# Altium project BrewController.PrjPcb (part 2 of 2)

## Sheet ESP32-WROOM-32D_Module.SchDoc
size A4
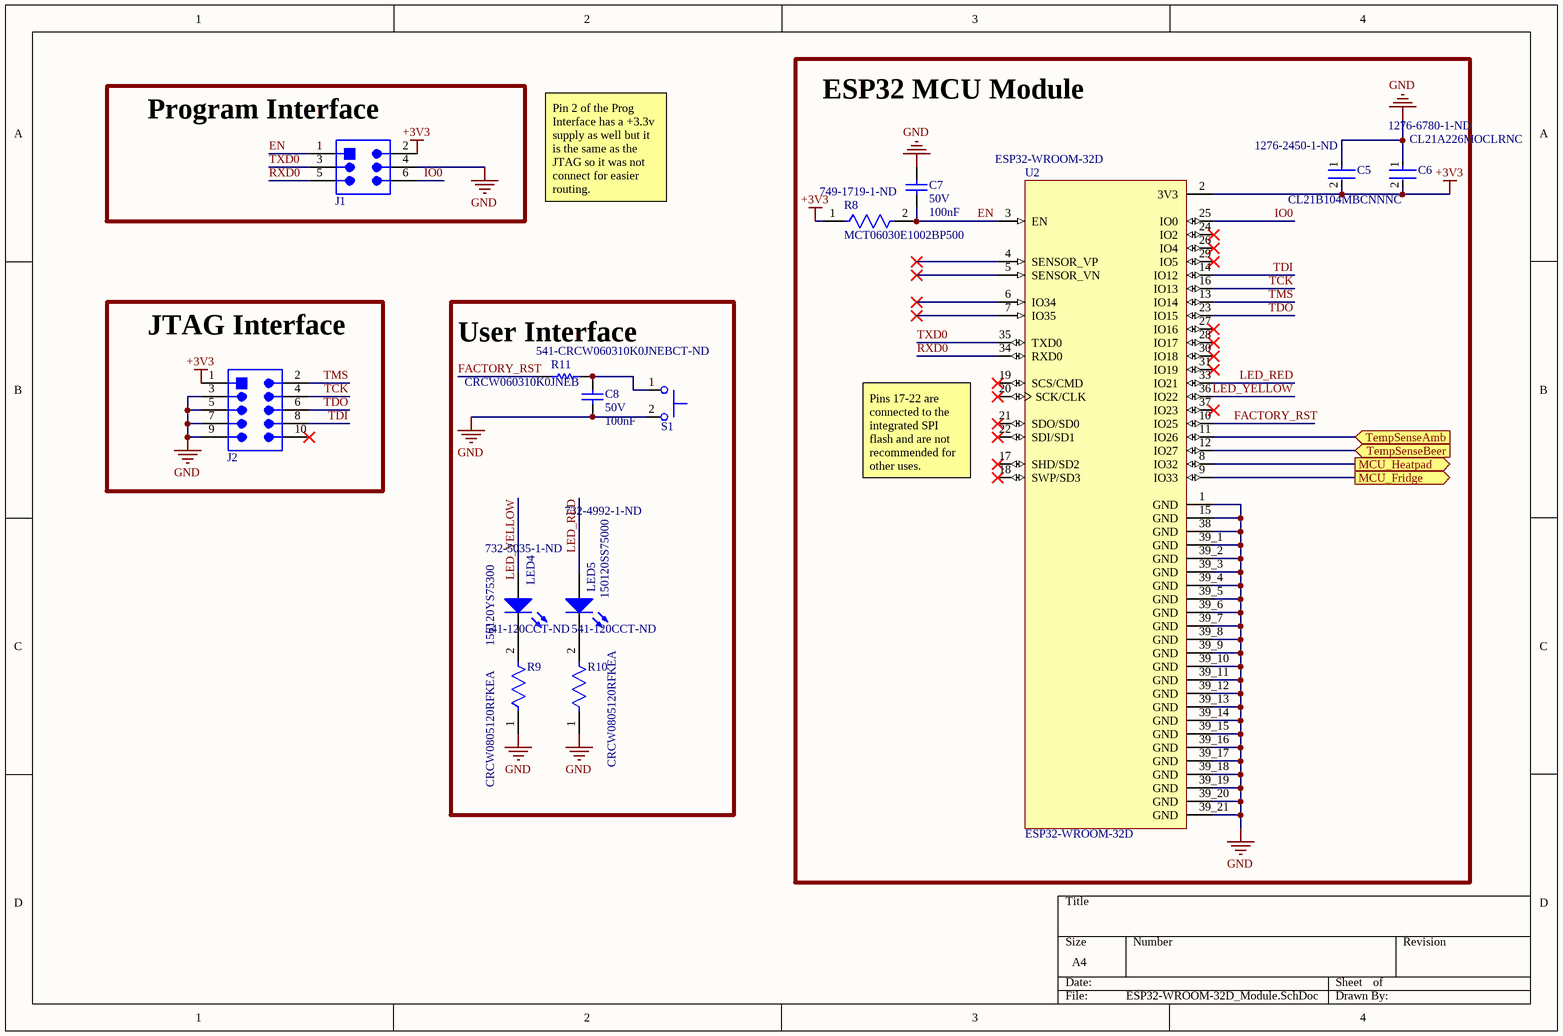
[diagram p2: ESP32-WROOM-32D_Module.SchDoc]

### Parts
C5  CL21B104MBCNNNC  Supplier Part Number 1: 1276-2450-1-ND  [FP-CL21-IPC_B]
C6  CL21A226MOCLRNC  Supplier Part Number 1: 1276-6780-1-ND  [FP-CL21-IPC_C]
C7  Voltage Rating (DC): 50V  Capacitance: 100nF  [C0805]  (hidden comment: Cap 0.1uF/50V 0805 X7R (CL21B104MBCNNNC))
C8  Voltage Rating (DC): 50V  Capacitance: 100nF  [C0805]  (hidden comment: Cap 0.1uF/50V 0805 X7R (CL21B104MBCNNNC))
J1  6Pos 1.27mm Unkeyed (20021111-00006T4LF)  [6Pos_1.27_Keyed]  (value not drawn)
J2  10Pos 1.27mm Keyed (3220-10-0100-00)  [10pos_1.27_Keyed]  (value not drawn)
LED4  156120YS75300  Supplier Part Number 1: 732-5035-1-ND  [1206  CYLINDRICAL- Reverse Use]
LED5  150120SS75000  Supplier Part Number 1: 732-4992-1-ND  [1206_A]
R8  MCT06030E1002BP500  Supplier Part Number 1: 749-1719-1-ND  [FP-MCT0603-MFG]
R9  CRCW0805120RFKEA  Supplier Part Number 1: 541-120CCT-ND  [FP-CRCW0805-e3-IPC_C]
R10  CRCW0805120RFKEA  Supplier Part Number 1: 541-120CCT-ND  [FP-CRCW0805-e3-IPC_C]
R11  CRCW060310K0JNEB  Supplier Part Number 1: 541-CRCW060310K0JNEBCT-ND  [RESC1609X50X30LL10T20]
S1  Right Angle SMT Edge Switch  [TL4110 Edge Connector]  (value not drawn)
U2  ESP32-WROOM-32D  [*MODULE_ESP32-WROOM-32D_ESP32-WROOM-32D(Primary)]

### Blocks framed on the sheet
Program Interface: J1
ESP32 MCU Module: C5-C7 R8 U2
JTAG Interface: J2
User Interface: C8 LED4 LED5 R9-R11 S1

### Ports
MCU_Fridge (out), MCU_Heatpad (out), TempSenseAmb (in), TempSenseBeer (in)

### Nets
+3V3: C5.2 C6.2 J1.2 J2.1 R8.1 U2.2(3V3)
GND: C5.1 C6.1 C7.2 C8.1 J1.4 J2.3 J2.5 J2.7 J2.9 R9.1 R10.1 S1.2 U2.1(GND) U2.15(GND) U2.38(GND) U2.39_1(GND) U2.39_2(GND) U2.39_3(GND) U2.39_4(GND) U2.39_5(GND) U2.39_6(GND) U2.39_7(GND) U2.39_8(GND) U2.39_9(GND) U2.39_10(GND) U2.39_11(GND) U2.39_12(GND) U2.39_13(GND) U2.39_14(GND) U2.39_15(GND) U2.39_16(GND) U2.39_17(GND) U2.39_18(GND) U2.39_19(GND) U2.39_20(GND) U2.39_21(GND)
EN: C7.1 J1.1 R8.2 U2.3(EN)
FACTORY_RST: R11.1 U2.10(IO25)
IO0: J1.6 U2.25(IO0)
LED_RED: LED5.2(A) U2.33(IO21)
LED_YELLOW: LED4.2(A) U2.36(IO22)
RXD0: J1.5 U2.34(RXD0)
TCK: J2.4 U2.16(IO13)
TDI: J2.8 U2.14(IO12)
TDO: J2.6 U2.23(IO15)
TMS: J2.2 U2.13(IO14)
TXD0: J1.3 U2.35(TXD0)
NetC8_2: C8.2 R11.2 S1.1
NetCON1_2: U2.11(IO26) ; port TempSenseAmb
NetCON2_2: U2.12(IO27) ; port TempSenseBeer
NetLED4_1: LED4.1(K) R9.2
NetLED5_1: LED5.1(K) R10.2
NetQ1_1: U2.8(IO32) ; port MCU_Heatpad
NetQ2_1: U2.9(IO33) ; port MCU_Fridge

Not connected (* = marked no-connect by the designer): J2 10*; U2 4(SENSOR_VP)* 5(SENSOR_VN)* 6(IO34)* 7(IO35)* 17(SHD/SD2)* 18(SWP/SD3)* 19(SCS/CMD)* 20(SCK/CLK)* 21(SDO/SD0)* 22(SDI/SD1)* 24(IO2)* 26(IO4)* 27(IO16)* 28(IO17)* 29(IO5)* 30(IO18)* 31(IO19)* 37(IO23)*

### Notes on the sheet
- Pin 2 of the Prog Interface has a +3.3v supply as well but it is the same as the JTAG so it was not connect for easier routing.
- Pins 17-22 are connected to the integrated SPI flash and are not recommended for other uses.

### Library data of the parts
C5 = CMP-13271-001110-1: CL21 Series 0805 100nF 50V ±20% Tolerance X7R Multilayer Ceramic Chip Capacitor; Manufacturer: Samsung; Description: Cap Ceramic 0.1uF 50V X7R 20% SMD 0805 125C Paper T/R; Depth: 1.25mm; Case Code (Imperial): 0805; Radiation Hardening: No; Length: 2mm; Voltage: 50V; Package Quantity: 1; Lead Free: Lead Free; Voltage Rating: 50V; Case/Package: 0805; Packaging: Tape and Reel; Thickness: 0.037inch; Case Code (Metric): 2012; Dielectric: X7R; Height: 0.85mm; Capacitance: 100nF; Mount: Surface Mount; Voltage Rating (DC): 50V; Tolerance: 20%; Width: 0.049inch; Max Operating Temperature: 125°C; Min Operating Temperature: -55°C; Supplier 1: Digi-Key; Manufacturer Part Number: CL21B104MBCNNNC; RoHS: Yes; Category: Ceramic Capacitors; Stock 1: 1894069; ComponentLink1URL: https://datasheet.ciiva.com/16428/cl21b104mbcnnnc-16428869.pdf?src-supplier=Future+Electronics; ComponentLink1Description: https://datasheet.ciiva.com/16428/cl21b104mbcnnnc-16428869.pdf?src-supplier=Future+Electronics; ComponentLink2URL: https://datasheet.ciiva.com/26838/getdatasheetpartid-746552-26838664.pdf?src-supplier=Verical; ComponentLink2Description: https://datasheet.ciiva.com/26838/getdatasheetpartid-746552-26838664.pdf?src-supplier=Verical; ComponentLink3URL: https://datasheet.ciiva.com/25780/cl21b104mbcnnnc-25780224.pdf?src-supplier=Digi-Key; ComponentLink3Description: https://datasheet.ciiva.com/25780/cl21b104mbcnnnc-25780224.pdf?src-supplier=Digi-Key
C6 = CMP-13271-002990-1: CL21 Series 0805 22uF 16V ±20% Tolerance X5R Multilayer Ceramic Chip Capacitor; Manufacturer: Samsung; Description: CAP CER 22UF 16V X5R 0805; Case Code (Imperial): 0805; Capacitance: 22uF; Max Operating Temperature: 85°C; Min Operating Temperature: -55°C; Packaging: Tape and Reel; Case Code (Metric): 2012; Case/Package: 0805; Mount: Surface Mount; Tolerance: 20%; Thickness: 0.037inch; Voltage Rating: 16V; Width: 0.049inch; Length: 0.079inch; Supplier 1: Digi-Key; Manufacturer Part Number: CL21A226MOCLRNC; RoHS: Yes; Category: Ceramic Capacitors; Stock 1: 613946; ComponentLink1URL: http://www.samsungsem.com/kr/support/product-search/mlcc/CL21A226MOCLRNC.jsp?src-supplier=Digi-Key; ComponentLink1Description: http://www.samsungsem.com/kr/support/product-search/mlcc/CL21A226MOCLRNC.jsp?src-supplier=Digi-Key
C7 C8 = Cap 0.1uF/50V 0805 X7R (CL21B104MBCNNNC): Cap Ceramic 0.1uF 50V X7R 20% SMD 0805 125C Paper T/R; Manufacturer 1: Samsung; Supplier 1: Digi-Key; Supplier Part Number 1: 1276-2450-1-ND; Manufacturer Part Number 1: CL21B104MBCNNNC; Stock 1: 1894069; Pricing 1: 1=0.10000, 10=0.04500, 100=0.02020, 500=0.01444, 1000=0.01134 (USD); RoHS: Yes; Mount: Surface Mount; Case/Package: 0805; Case Code (Imperial): 0805; Case Code (Metric): 2012; Min Operating Temperature: -55°C; Max Operating Temperature: 125°C; Tolerance: 20%; Dielectric: X7R; Voltage: 50V; Package Quantity: 1; Packaging: Tape and Reel; Length: 2mm; Height: 0.85mm; Depth: 1.25mm; Width: 0.049inch; Thickness: 0.037inch; Radiation Hardening: No; Lead Free: Lead Free; ComponentLink1URL: https://datasheet.ciiva.com/16428/cl21b104mbcnnnc-16428869.pdf?src-supplier=Future+Electronics; ComponentLink1Description: https://datasheet.ciiva.com/16428/cl21b104mbcnnnc-16428869.pdf?src-supplier=Future+Electronics; ComponentLink2URL: https://datasheet.ciiva.com/26838/getdatasheetpartid-746552-26838664.pdf?src-supplier=Verical; ComponentLink2Description: https://datasheet.ciiva.com/26838/getdatasheetpartid-746552-26838664.pdf?src-supplier=Verical; ComponentLink3URL: https://datasheet.ciiva.com/25780/cl21b104mbcnnnc-25780224.pdf?src-supplier=Digi-Key; ComponentLink3Description: https://datasheet.ciiva.com/25780/cl21b104mbcnnnc-25780224.pdf?src-supplier=Digi-Key; Voltage Rating: 50V; Manufacturer: Samsung; Manufacturer Part Number: CL21B104MBCNNNC; Category: Ceramic Capacitors
J1 = 6Pos 1.27mm Unkeyed (20021111-00006T4LF): CONN HEADER 6POS UNSHD VERT T/H; Manufacturer 1: Amphenol FCI; Number of Contacts: 6; Max Voltage Rating (AC): 125V; Insulation Resistance: 100MR; Connector Type: Male Pin,Header; Gender: Male; Contact Resistance: 30mR; Current Rating: 6A; Contact Post Length: 2.3mm; Row Spacing: 0.05inch; Supplier 1: Digi-Key; Supplier Part Number 1: 609-3710-ND; Manufacturer Part Number 1: 20021111-00006T4LF; Stock 1: 8493; Pricing 1: 1=0.42000, 10=0.39200, 100=0.30080, 500=0.26160, 1000=0.21582, 5000=0.18966, 10000=0.17658 (USD); RoHS: Yes; Mount: Through Hole; Contact Plating: Gold; Housing Material: Thermoplastic; Contact Material: Nickel,Copper Alloy,Copper,Gold; Color: Black; Housing Color: Black; Min Operating Temperature: -40°C; Max Operating Temperature: 85°C; Termination: Solder; Number of Rows: 2; Packaging: Rail/Tube; Package Quantity: 153; Voltage Rating: 125V; Orientation: Straight; Number of Positions: 6; Length: 3.81mm; Pitch: 1.27mm; Depth: 3.4mm; Contact Mating Length: 0.12inch; REACH SVHC: No SVHC; Lead Free: Lead Free; ComponentLink1URL: https://datasheet.ciiva.com/1433/1079612-1433265.pdf?src-supplier=Element14; ComponentLink1Description: https://datasheet.ciiva.com/1433/1079612-1433265.pdf?src-supplier=Element14; ComponentLink2URL: https://datasheet.ciiva.com/10033/20021111-10033816.pdf?src-supplier=Avnet; ComponentLink2Description: https://datasheet.ciiva.com/10033/20021111-10033816.pdf?src-supplier=Avnet; ComponentLink3URL: https://datasheet.ciiva.com/409/20021111-409250.pdf?src-supplier=Digi-Key; ComponentLink3Description: https://datasheet.ciiva.com/409/20021111-409250.pdf?src-supplier=Digi-Key; ComponentLink4URL: https://datasheet.ciiva.com/5131/20021111-5131319.pdf?src-supplier=Mouser; ComponentLink4Description: https://datasheet.ciiva.com/5131/20021111-5131319.pdf?src-supplier=Mouser; Manufacturer: Amphenol FCI; Manufacturer Part Number: 20021111-00006T4LF; Category: Headers and Wire Housings
J2 = 10Pos 1.27mm Keyed (3220-10-0100-00): CONN HEADER VERT 10POS 1.27MM; Manufacturer 1: CNC Tech; Connector Type: Male Pin; Number of Positions: 10; Pitch: 0.05inch; Supplier 1: Digi-Key; Supplier Part Number 1: 1175-1627-ND; Manufacturer Part Number 1: 3220-10-0100-00; Stock 1: 83441; Pricing 1: 1=0.58000, 10=0.54000, 100=0.41400, 500=0.36000, 1000=0.29700, 5000=0.26100, 10000=0.24300 (USD); RoHS: Yes; Mount: Through Hole; Contact Plating: Gold; Package Quantity: 3200; Packaging: Tray; Number of Rows: 2; Termination: Solder; Row Spacing: 0.05inch; ComponentLink1URL: https://datasheet.ciiva.com/18655/3220-xx-0100-00-18655342.pdf?src-supplier=Digi-Key; ComponentLink1Description: https://datasheet.ciiva.com/18655/3220-xx-0100-00-18655342.pdf?src-supplier=Digi-Key; Manufacturer: CNC Tech; Manufacturer Part Number: 3220-10-0100-00; Category: Headers and Wire Housings
LED4 = CMP-1428-00001-1: SMD mono-color reverse mount waterclear Chip LED, WL-SMRW, Yellow; Manufacturer: Wuerth Elektronik; Lens Type: Cylindrical; Luminous Intensity: 80mcd; Viewing Angle: 140°; Forward Voltage: 2V; Wavelength: 589nm; Forward Current: 25mA; Test Current: 20mA; ComponentLink2URL: http://katalog.we-online.com/led/datasheet/156120YS75300.pdf; ComponentLink1Description: Manufacturer URL; Color: Yellow; ComponentLink2Description: Datasheet; PackageReference: 1206  CYLINDRICAL- Reverse Use; ComponentLink1URL: http://www.we-online.com; PartNumber: 156120YS75300; Supplier 1: Digi-Key; Manufacturer Part Number: 156120YS75300; RoHS: Yes; Category: LEDs; Stock 1: 2873; Mount: Surface Mount; Case/Package: 1206; Case Code (Metric): 3216; Case Code (Imperial): 1206; Min Operating Temperature: -40°C; Max Operating Temperature: 80°C; Package Quantity: 2000; Packaging: Tape and Reel; Lens Style: Cylindrical; Dominant Wavelength: 589nm; Length: 3.2mm; Height: 1.2mm; Width: 1.6mm; REACH SVHC: Unknown; ComponentLink3URL: https://datasheet.ciiva.com/23843/156120ys75300-23843300.pdf?src-supplier=Newark; ComponentLink3Description: https://datasheet.ciiva.com/23843/156120ys75300-23843300.pdf?src-supplier=Newark; ComponentLink4URL: https://datasheet.ciiva.com/29279/759454-da-01-en-smd-chipled-rev-gelb-156120ys75300-29279081.pdf?src-supplier=Conrad; ComponentLink4Description: https://datasheet.ciiva.com/29279/759454-da-01-en-smd-chipled-rev-gelb-156120ys75300-29279081.pdf?src-supplier=Conrad; ComponentLink5URL: https://datasheet.ciiva.com/29562/156120ys75300-29562981.pdf?src-supplier=Digi-Key; ComponentLink5Description: https://datasheet.ciiva.com/29562/156120ys75300-29562981.pdf?src-supplier=Digi-Key; ComponentLink6URL: https://datasheet.ciiva.com/29562/156120ys75300-29562982.pdf?src-supplier=Digi-Key; ComponentLink6Description: https://datasheet.ciiva.com/29562/156120ys75300-29562982.pdf?src-supplier=Digi-Key; ComponentLink7URL: https://datasheet.ciiva.com/29562/156120ys75300-29562983.pdf?src-supplier=Digi-Key; ComponentLink7Description: https://datasheet.ciiva.com/29562/156120ys75300-29562983.pdf?src-supplier=Digi-Key; ComponentLink8URL: https://datasheet.ciiva.com/22657/1911476-22657082.pdf?src-supplier=Element14; ComponentLink8Description: https://datasheet.ciiva.com/22657/1911476-22657082.pdf?src-supplier=Element14; ComponentLink9URL: https://datasheet.ciiva.com/48430/156120ys75300-eng-tds-48430218.pdf?src-supplier=Distrelec; ComponentLink9Description: https://datasheet.ciiva.com/48430/156120ys75300-eng-tds-48430218.pdf?src-supplier=Distrelec
LED5 = CMP-1426-00017-1: SMD mono-color Chip LED, WL-SMCW, Super Red; Manufacturer: Wuerth Elektronik; Viewing Angle: 140°; Lens Style: Clear,Rectangular; Luminous Intensity: 60mcd; Forward Current: 30mA; Forward Voltage: 1.9V; Wavelength: 630nm; Test Current: 20mA; ComponentLink1URL: http://www.we-online.com; PackageReference: 1206_A; ComponentLink2Description: Datasheet; ComponentLink1Description: Manufacturer URL; ComponentLink2URL: http://katalog.we-online.com/led/datasheet/150120SS75000.pdf; Color: Super Red; PartNumber: 150120SS75000; Supplier 1: Digi-Key; Manufacturer Part Number: 150120SS75000; RoHS: Yes; Category: LEDs; Stock 1: 1722; Mount: Surface Mount; Case/Package: 1206; Case Code (Metric): 3216; Case Code (Imperial): 1206; Min Operating Temperature: -40°C; Max Operating Temperature: 85°C; Package Quantity: 3000; Packaging: Tape and Reel; Dominant Wavelength: 630nm; Length: 3.2mm; Height: 0.68mm; Width: 1.6mm; REACH SVHC: Unknown; ComponentLink3URL: https://datasheet.ciiva.com/29561/150120ss75000-29561862.pdf?src-supplier=Digi-Key; ComponentLink3Description: https://datasheet.ciiva.com/29561/150120ss75000-29561862.pdf?src-supplier=Digi-Key; ComponentLink4URL: https://datasheet.ciiva.com/29279/759443-da-01-en-chipled-1206-w-kl-s-rot-150120ss75000-29279053.pdf?src-supplier=Conrad; ComponentLink4Description: https://datasheet.ciiva.com/29279/759443-da-01-en-chipled-1206-w-kl-s-rot-150120ss75000-29279053.pdf?src-supplier=Conrad; ComponentLink5URL: https://datasheet.ciiva.com/29561/150120ss75000-29561863.pdf?src-supplier=Digi-Key; ComponentLink5Description: https://datasheet.ciiva.com/29561/150120ss75000-29561863.pdf?src-supplier=Digi-Key; ComponentLink6URL: https://datasheet.ciiva.com/48430/150120ss75000-eng-tds-48430055.pdf?src-supplier=Distrelec; ComponentLink6Description: https://datasheet.ciiva.com/48430/150120ss75000-eng-tds-48430055.pdf?src-supplier=Distrelec; ComponentLink7URL: https://datasheet.ciiva.com/29561/150120ss75000-29561864.pdf?src-supplier=Digi-Key; ComponentLink7Description: https://datasheet.ciiva.com/29561/150120ss75000-29561864.pdf?src-supplier=Digi-Key
R8 = CMP-02407-000334-1: RES SMD 100 OHM 1% 1/8W 0603; Manufacturer: Vishay BCcomponents; Max Power Dissipation: 100mW; Resistance: 10kR; Voltage Rating (DC): 75V; Temperature Coefficient: 15ppm/°C; Tolerance: 0.1%; Height: 0.022inch; Length: 0.061inch; Width: 0.033inch; Depth: 0.85mm; Case/Package: 0603; Min Operating Temperature: -55°C; Package Quantity: 5000; Voltage Rating: 75V; Contact Plating: Tin; REACH SVHC: No SVHC; Case Code (Imperial): 0603; Max Operating Temperature: 125°C; Composition: Thin Film; Radiation Hardening: No; Power Rating: 100mW; Packaging: Tape and Reel; Military Standard: Not; Case Code (Metric): 1608; Number of Terminations: 2; Lead Free: Lead Free; Supplier 1: Digi-Key; Manufacturer Part Number: MCT06030E1002BP500; RoHS: Yes; Category: Chip SMD Resistors; Stock 1: 21385; Resistor Type: Thin Film; ComponentLink1URL: https://datasheet.ciiva.com/8897/mc-pre-8897866.pdf?src-supplier=Avnet; ComponentLink1Description: https://datasheet.ciiva.com/8897/mc-pre-8897866.pdf?src-supplier=Avnet; ComponentLink2URL: https://datasheet.ciiva.com/2606/mc-pre-2606078.pdf?src-supplier=Digi-Key; ComponentLink2Description: https://datasheet.ciiva.com/2606/mc-pre-2606078.pdf?src-supplier=Digi-Key
R9 R10 = CMP-02407-007854-1: RES Thick Film, 120Ω, 1%, 0.125W, 100ppm/°C, 0805; Manufacturer: Vishay; Resistance: 120R; Voltage Rating (DC): 150V; Max Power Dissipation: 125mW; Height: 0.45mm; Min Operating Temperature: -55°C; Packaging: Tape and Reel; Package Quantity: 10; Width: 1.25mm; Weight: 0.000194oz; Termination: SMD/SMT; Mount: Surface Mount; Tolerance: 1%; Military Standard: Not; Max Operating Temperature: 155°C; Lead Free: Lead Free; Number of Terminations: 2; Radiation Hardening: No; Temperature Coefficient: 100ppm/°C; Length: 2mm; Case/Package: 0805; Voltage Rating: 150V; Case Code (Metric): 2012; Case Code (Imperial): 0805; Features: Automotive AEC-Q200; Composition: Thick Film; Contact Plating: Tin; Power Rating: 125mW; Depth: 1.25mm; Supplier 1: Digi-Key; Manufacturer Part Number: CRCW0805120RFKEA; RoHS: Yes; Category: Chip SMD Resistors; Stock 1: 76539; Resistor Type: Thick Film; REACH SVHC: Unknown; ComponentLink1URL: https://datasheet.ciiva.com/11810/0900766b80d98b26-11810477.pdf?src-supplier=RSComponents; ComponentLink1Description: https://datasheet.ciiva.com/11810/0900766b80d98b26-11810477.pdf?src-supplier=RSComponents; ComponentLink2URL: https://datasheet.ciiva.com/3258/dcrcwe3-3258069.pdf?src-supplier=Avnet; ComponentLink2Description: https://datasheet.ciiva.com/3258/dcrcwe3-3258069.pdf?src-supplier=Avnet; ComponentLink3URL: https://datasheet.ciiva.com/26317/fld-crcw-e3-data-en-26317334.pdf?src-supplier=Distrelec; ComponentLink3Description: https://datasheet.ciiva.com/26317/fld-crcw-e3-data-en-26317334.pdf?src-supplier=Distrelec; ComponentLink4URL: https://datasheet.ciiva.com/2467/dcrcwe3-2467512.pdf?src-supplier=Digi-Key; ComponentLink4Description: https://datasheet.ciiva.com/2467/dcrcwe3-2467512.pdf?src-supplier=Digi-Key; ComponentLink5URL: https://datasheet.ciiva.com/2467/dcrcwe3-2467513.pdf?src-supplier=Digi-Key; ComponentLink5Description: https://datasheet.ciiva.com/2467/dcrcwe3-2467513.pdf?src-supplier=Digi-Key; ComponentLink6URL: https://datasheet.ciiva.com/16852/dcrcwe3-16852841.pdf?src-supplier=Avnet+Europe; ComponentLink6Description: https://datasheet.ciiva.com/16852/dcrcwe3-16852841.pdf?src-supplier=Avnet+Europe; ComponentLink7URL: https://datasheet.ciiva.com/2467/dcrcwe3-2467514.pdf?src-supplier=Digi-Key; ComponentLink7Description: https://datasheet.ciiva.com/2467/dcrcwe3-2467514.pdf?src-supplier=Digi-Key; ComponentLink8URL: https://datasheet.ciiva.com/7777/1697337-7777354.pdf?src-supplier=Element14; ComponentLink8Description: https://datasheet.ciiva.com/7777/1697337-7777354.pdf?src-supplier=Element14; ComponentLink9URL: https://datasheet.ciiva.com/16788/70201119-16788154.pdf?src-supplier=Allied+Electronics; ComponentLink9Description: https://datasheet.ciiva.com/16788/70201119-16788154.pdf?src-supplier=Allied+Electronics; ComponentLink10URL: https://datasheet.ciiva.com/16211/dcrcwe3-16211931.pdf?src-supplier=Future+Electronics; ComponentLink10Description: https://datasheet.ciiva.com/16211/dcrcwe3-16211931.pdf?src-supplier=Future+Electronics; ComponentLink11URL: https://datasheet.ciiva.com/7777/1720486-7777567.pdf?src-supplier=Element14; ComponentLink11Description: https://datasheet.ciiva.com/7777/1720486-7777567.pdf?src-supplier=Element14
R11 = CMP-2000-03839-1: Res Thick Film 0603 10K Ohm 5% 0.1W(1/10W) ±200ppm/C Molded SMD Automotive Paper T/R; Manufacturer: Vishay Dale; Resistance: 10kR; Temperature Coefficient: 200ppm/°C; Max Power Dissipation: 100mW; Voltage Rating: 75V; Part Number: CRCW060310K0JNEB; Supplier 1: Digi-Key; Manufacturer Part Number: CRCW060310K0JNEB; RoHS: Yes; Category: Chip SMD Resistors; Stock 1: 86; Case/Package: 0603; Weight: 7.1E-05oz; Case Code (Imperial): 0603; Case Code (Metric): 1608; Contact Plating: Tin; Min Operating Temperature: -55°C; Max Operating Temperature: 155°C; Packaging: Tape and Reel; Tolerance: 5%; Resistor Type: Thick Film; Number of Terminations: 2; Power Rating: 100mW; Package Quantity: 10000; Termination: SMD/SMT; Voltage Rating (DC): 75V; Features: Automotive AEC-Q200; Length: 1.55mm; Height: 0.02inch; Width: 0.85mm; Depth: 0.85mm; Radiation Hardening: No; REACH SVHC: Unknown; Military Standard: Not; Lead Free: Lead Free; ComponentLink1URL: https://datasheet.ciiva.com/28588/1747939-28588894.pdf?src-supplier=Element14; ComponentLink1Description: https://datasheet.ciiva.com/28588/1747939-28588894.pdf?src-supplier=Element14; ComponentLink2URL: https://datasheet.ciiva.com/16426/dcrcwe3-16426303.pdf?src-supplier=Future+Electronics; ComponentLink2Description: https://datasheet.ciiva.com/16426/dcrcwe3-16426303.pdf?src-supplier=Future+Electronics
S1 = Right Angle SMT Edge Switch: RIGHT ANGLE SMT TACT SWITCH 2.0M; Manufacturer 1: E-Switch; Manufacturer Part Number 1: TL4110AF160Q; Mechanical Life: 300000Cycles; Throw Configuration: SPST; Illumination Type: Non-Illuminated; Switch Function: Off-Mom; Actuator Type: Standard; Operating Force: 160gf; Switch Travel: 0.13mm; Supplier 1: Digi-Key; Supplier Part Number 1: EG5545CT-ND; RoHS: No; Category: Tactile Switches; Stock 1: 4332; Pricing 1: 1=0.70000, 10=0.67200, 25=0.64640, 100=0.56090, 250=0.51184, 500=0.47564, 1000=0.42653, 2500=0.40068 (USD); Mount: Edge; Min Operating Temperature: -40°C; Max Operating Temperature: 85°C; Packaging: Tape and Reel; Termination: Gull Wing; ComponentLink1URL: https://media.digikey.com/pdf/Data%20Sheets/E-Switch%20PDFs/TL4110_Series_Tact_Switch.pdf?src-supplier=Digi-Key; ComponentLink1Description: https://media.digikey.com/pdf/Data%20Sheets/E-Switch%20PDFs/TL4110_Series_Tact_Switch.pdf?src-supplier=Digi-Key; Manufacturer: E-Switch; Manufacturer Part Number: TL4110AF160Q
U2 = ESP32-WROOM-32D: Wi-Fi/BT BLE Module ESP32-D0WD, SPI Flash, UART, P; Manufacturer 1: Espressif Systems; Interface: I2C,SPI,GPIO,PWM,SDIO,UART; Frequency: 2.5GHz; Data Rate: 150Mbps; Sensitivity: -98dBm; Memory Size: 536KB; Supplier 1: Digi-Key; Supplier Part Number 1: 1904-1023-1-ND; Manufacturer Part Number 1: ESP32-WROOM-32D; Stock 1: 1335; Pricing 1: 1=3.80000 (USD); RoHS: No; Mount: Surface Mount; Case/Package: SMD/SMT; Min Operating Temperature: -40°C; Max Operating Temperature: 85°C; Packaging: Cut Tape; ComponentLink1URL: https://www.espressif.com/sites/default/files/documentation/esp32-wroom-32d_esp32-wroom-32u_datasheet_en.pdf?src-supplier=Digi-Key; ComponentLink1Description: https://www.espressif.com/sites/default/files/documentation/esp32-wroom-32d_esp32-wroom-32u_datasheet_en.pdf?src-supplier=Digi-Key; Supplier 2: Arrow Electronics; Supplier Part Number 2: ESP32-WROOM-32D; Manufacturer: Espressif Systems; Manufacturer Part Number: ESP32-WROOM-32D; Category: RF Receivers, Transceivers

## Sheet Power.SchDoc
size A4
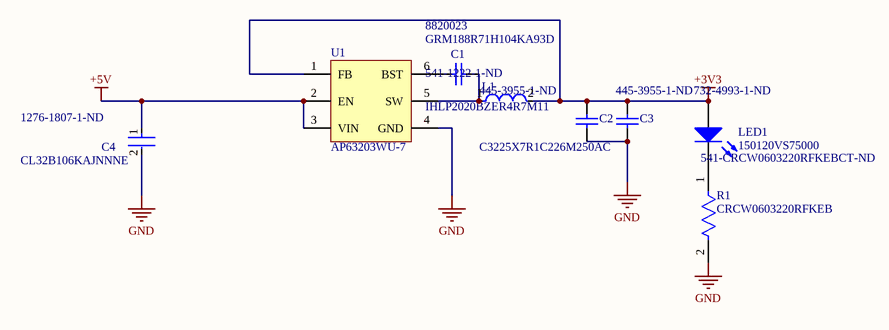
[diagram p3: Power.SchDoc]

### Parts
C1  GRM188R71H104KA93D  Supplier Part Number 1: 8820023  [CAPC1608X90X35ML10T15]
C2  C3225X7R1C226M250AC  Supplier Part Number 1: 445-3955-1-ND  [CAPC3225X280X20LL40]
C3  Supplier Part Number 1: 445-3955-1-ND  [CAPC3225X280X20LL40]  (hidden comment: C3225X7R1C226M250AC)
C4  CL32B106KAJNNNE  Supplier Part Number 1: 1276-1807-1-ND  [FP-CL32-IPC_C]
L1  IHLP2020BZER4R7M11  Supplier Part Number 1: 541-1222-1-ND  [FP-IHLP-2020BZ-FP_1_905x2-MFG]
LED1  150120VS75000  Supplier Part Number 1: 732-4993-1-ND  [1206_A]
R1  CRCW0603220RFKEB  Supplier Part Number 1: 541-CRCW0603220RFKEBCT-ND  [FP-CRCW0603-e3-MFG]
U1  Manufacturer Part Number 1: AP63203WU-7  [TSOT26]  (hidden comment: 3.3V SW Reg (AP63203WU-7))

### Nets
+3V3: C2.2 C3.2 L1.2 LED1.2(A) U1.1(FB)
+5V: C4.1 U1.2(EN) U1.3(VIN)
GND: C2.1 C3.1 C4.2 R1.2 U1.4(GND)
NetC1_1: C1.1 L1.1 U1.5(SW)
NetC1_2: C1.2 U1.6(BST)
NetLED1_1: LED1.1(K) R1.1

### Library data of the parts
C1 = CMP-2100-03643-1: Chip Capacitor, 0.1 uF, +/- 10%, 50 V, -55 to 125 degC, 0603 (1608 Metric), RoHS, Tape and Reel; Manufacturer: Murata; Dielectric Material: Ceramic; Voltage Rating: 50V; Capacitance: 100nF; Dielectric: X7R; Insulation Resistance: 10GR; Description: CERAMIC CAPACITOR, 0.1UF, 50V, X7R, 10%, 0603, FULL REEL; Product Range:GRM Series; Capacitance:0.1 F; Capacitance Tolerance:  10%; Dielectric Characteristic:X7R; Voltage Rating:50V; Ceramic Capacitor Case:0603 ^1608 Metric]; MSL:-; Case Code (Metric): 1608; Lead Free: LeadFree; Depth: 0.8mm; Number of Pins: 2; Radiation Hardening: No; Case/Package: 0603; Manufacturer URL: http://www.murata.com/; Packaging: TapeandReel; Length: 1.6mm; Contact Plating: Tin; Datasheet URL: http://psearch.en.murata.com/capacitor/product/GRM188R71H104KA93%23.pdf; Tolerance: 10%; Case Code (Imperial): 0603; Min Operating Temperature: -55degC; RoHSCompliant: true; Voltage: 50V; Termination: SMD/SMT; Mount: SurfaceMount; Material: Ceramic; Package Quantity: 1; Height: 0.8mm; Thickness: 0.035inch; REACH SVHC: NoSVHC; Max Operating Temperature: 125degC; Width: 0.8mm; Package Reference: 0603; Voltage Rating (DC): 50V; Datasheet Version: 42675.0; Package Description: 2-Pin Surface Mount Device, Body 1.6 x 0.8 mm; Supplier 1: Farnell; Manufacturer Part Number: GRM188R71H104KA93D; RoHS: Yes; Category: Ceramic Capacitors; ComponentLink1URL: https://datasheet.ciiva.com/11786/0900766b807a1cab-11786047.pdf?src-supplier=RSComponents; ComponentLink1Description: https://datasheet.ciiva.com/11786/0900766b807a1cab-11786047.pdf?src-supplier=RSComponents; ComponentLink2URL: https://datasheet.ciiva.com/19467/1857604-19467681.pdf?src-supplier=Jameco; ComponentLink2Description: https://datasheet.ciiva.com/19467/1857604-19467681.pdf?src-supplier=Jameco; ComponentLink3URL: https://datasheet.ciiva.com/29201/451744-da-01-en-vs-kondensator-0603-29201904.pdf?src-supplier=Conrad; ComponentLink3Description: https://datasheet.ciiva.com/29201/451744-da-01-en-vs-kondensator-0603-29201904.pdf?src-supplier=Conrad; ComponentLink4URL: https://datasheet.ciiva.com/28534/4360-28534245.pdf?src-supplier=Element14; ComponentLink4Description: https://datasheet.ciiva.com/28534/4360-28534245.pdf?src-supplier=Element14; ComponentLink5URL: https://datasheet.ciiva.com/131/partnumbering-e-01-131738.pdf?src-supplier=Digi-Key; ComponentLink5Description: https://datasheet.ciiva.com/131/partnumbering-e-01-131738.pdf?src-supplier=Digi-Key; ComponentLink6URL: https://datasheet.ciiva.com/131/partnumbering-e-01-131739.pdf?src-supplier=Digi-Key; ComponentLink6Description: https://datasheet.ciiva.com/131/partnumbering-e-01-131739.pdf?src-supplier=Digi-Key; ComponentLink7URL: https://datasheet.ciiva.com/7937/4360-7937659.pdf?src-supplier=Element14; ComponentLink7Description: https://datasheet.ciiva.com/7937/4360-7937659.pdf?src-supplier=Element14; ComponentLink8URL: https://datasheet.ciiva.com/7937/1747470-7937658.pdf?src-supplier=Element14; ComponentLink8Description: https://datasheet.ciiva.com/7937/1747470-7937658.pdf?src-supplier=Element14; ComponentLink9URL: https://datasheet.ciiva.com/48436/nmgrm-data-en-48436667.pdf?src-supplier=Distrelec; ComponentLink9Description: https://datasheet.ciiva.com/48436/nmgrm-data-en-48436667.pdf?src-supplier=Distrelec; ComponentLink10URL: https://datasheet.ciiva.com/131/partnumbering-e-01-131740.pdf?src-supplier=Digi-Key; ComponentLink10Description: https://datasheet.ciiva.com/131/partnumbering-e-01-131740.pdf?src-supplier=Digi-Key; ComponentLink11URL: https://datasheet.ciiva.com/14116/nmgrm-data-en-14116602.pdf?src-supplier=Distrelec; ComponentLink11Description: https://datasheet.ciiva.com/14116/nmgrm-data-en-14116602.pdf?src-supplier=Distrelec
C2 C3 = CMP-2000-06052-1: Multilayer Ceramic Capacitor, 22 uF, 16 V, -55 to 125 degC, 2-Pin SMD, RoHS, Tape and Reel; PCN Part Number: MLCCPartNumberChange30/Nov/2012; Manufacturer: TDK; Tolerance: ±20%; Online Catalog: CSeries,GeneralPurpose; Catalog Drawings: CSERIES_1210_2.8; Capacitance: 22µF; Voltage - Rated: 16V; Temperature Coefficient: X7R; Other Names: 445-3955-6; Product Training Modules: HighCapacitanceReplacementCSeriesGeneralApplicationsSEAT,CCV,andTVCLDesignToolsGuidetoReplacinganElectrolyticCapacitorwithanMLCC; Description: TDK - C3225X7R1C226M250AC - SMD Multilayer Ceramic Capacitor, 22 &#181;F, 16 V, 1210 [3225 Metric], &#177; 20%, X7R, C Series; Lead Style: -; Thickness (Max): 0.110"(2.80mm); Lead Spacing: -; Package Reference: 1210; Package / Case: 1210(3225Metric); Operating Temperature: -55°C~125°C; Standard Package: 1; Features: -; Datasheet URL: https://datasheet.ciiva.com/24216/c3225x7r1c226m250ac-265468-24216381.pdf; Manufacturer URL: http://www.tdk.com/; Datasheet Version: 09/2013; Mounting Technology: SurfaceMount; Family: CeramicCapacitors; Height - Seated (Max): -; Mounting Type: SurfaceMount,MLCC; Series: C; Size / Dimension: 0.126"Lx0.098"W(3.20mmx2.50mm); Packaging: Digi-Reel®; Ratings: -; Package Description: 2-Pin Surface Mount Device, Body 3.2 x 2.5 mm; Applications: GeneralPurpose; RoHS Information: RoHSCertificate-MLCC; Category: Capacitors; Supplier 1: Digi-Key; Manufacturer Part Number: C3225X7R1C226M250AC; RoHS: Yes; Stock 1: 684134; Mount: Surface Mount; Case/Package: 1210; Number of Pins: 2; Weight: 0.000564oz; Case Code (Metric): 3225; Case Code (Imperial): 1210; Dielectric Material: Ceramic; Min Operating Temperature: -55°C; Max Operating Temperature: 125°C; Dielectric: X7R; Package Quantity: 1; Voltage Rating: 16V; Voltage Rating (DC): 16V; Termination: SMD/SMT; Resistor Type: Ceramic; Length: 3.2mm; Height: 2.5mm; Depth: 2.5mm; Width: 0.098inch; Thickness: 0.11inch; Radiation Hardening: No; REACH SVHC: No SVHC; Lead Free: Lead Free; ComponentLink1URL: https://datasheet.ciiva.com/24216/c3225x7r1c226m250ac-265468-24216381.pdf?src-supplier=Mouser; ComponentLink1Description: https://datasheet.ciiva.com/24216/c3225x7r1c226m250ac-265468-24216381.pdf?src-supplier=Mouser; ComponentLink2URL: https://datasheet.ciiva.com/6252/tdkmlcccaprange-6252933.pdf?src-supplier=Digi-Key; ComponentLink2Description: https://datasheet.ciiva.com/6252/tdkmlcccaprange-6252933.pdf?src-supplier=Digi-Key; ComponentLink3URL: https://datasheet.ciiva.com/7975/639999-7975159.pdf?src-supplier=Element14; ComponentLink3Description: https://datasheet.ciiva.com/7975/639999-7975159.pdf?src-supplier=Element14; ComponentLink4URL: https://datasheet.ciiva.com/6145/1571323-6145128.pdf?src-supplier=Farnell; ComponentLink4Description: https://datasheet.ciiva.com/6145/1571323-6145128.pdf?src-supplier=Farnell; ComponentLink5URL: https://datasheet.ciiva.com/28620/1571323-28620648.pdf?src-supplier=Element14; ComponentLink5Description: https://datasheet.ciiva.com/28620/1571323-28620648.pdf?src-supplier=Element14; ComponentLink6URL: https://datasheet.ciiva.com/6252/tdkmlcccaprange-6252937.pdf?src-supplier=Digi-Key; ComponentLink6Description: https://datasheet.ciiva.com/6252/tdkmlcccaprange-6252937.pdf?src-supplier=Digi-Key; ComponentLink7URL: https://datasheet.ciiva.com/17487/e412-c-17487337.pdf?src-supplier=Avnet+Europe; ComponentLink7Description: https://datasheet.ciiva.com/17487/e412-c-17487337.pdf?src-supplier=Avnet+Europe; ComponentLink8URL: https://datasheet.ciiva.com/15192/getdatasheetpartid-715071-15192314.pdf?src-supplier=Verical; ComponentLink8Description: https://datasheet.ciiva.com/15192/getdatasheetpartid-715071-15192314.pdf?src-supplier=Verical; ComponentLink9URL: https://datasheet.ciiva.com/6252/tdkmlcccaprange-6252940.pdf?src-supplier=Digi-Key; ComponentLink9Description: https://datasheet.ciiva.com/6252/tdkmlcccaprange-6252940.pdf?src-supplier=Digi-Key; ComponentLink10URL: https://datasheet.ciiva.com/7878/1571323-7878125.pdf?src-supplier=Element14; ComponentLink10Description: https://datasheet.ciiva.com/7878/1571323-7878125.pdf?src-supplier=Element14; ComponentLink11URL: https://datasheet.ciiva.com/16199/e412-c-16199357.pdf?src-supplier=Future+Electronics; ComponentLink11Description: https://datasheet.ciiva.com/16199/e412-c-16199357.pdf?src-supplier=Future+Electronics
C4 = CMP-13271-001383-1: Cap Ceramic 10uF 25V X7R ±10% SMD 1210 +125°C Embossed T/R; Manufacturer: Samsung; Description: Cap Ceramic 10uF 25V X7R 10% SMD 1210 125C Embossed T/R; Capacitance: 10uF; Width: 0.098inch; Min Operating Temperature: -55°C; Case Code (Metric): 3225; Case Code (Imperial): 1210; Material: Ceramic; Height: 2.5mm; Depth: 2.5mm; Contact Plating: Tin; Max Operating Temperature: 125°C; Length: 3.2mm; Mount: Surface Mount; Packaging: Tape and Reel; Dielectric: X7R; Tolerance: 10%; Radiation Hardening: No; Thickness: 0.106inch; Package Quantity: 1000; Voltage Rating: 25V; Voltage: 25V; Case/Package: 1210; Supplier 1: Digi-Key; Manufacturer Part Number: CL32B106KAJNNNE; RoHS: Yes; Category: Ceramic Capacitors; Stock 1: 108118; ComponentLink1URL: https://datasheet.ciiva.com/25791/cl32b106kajnnne-25791845.pdf?src-supplier=Digi-Key; ComponentLink1Description: https://datasheet.ciiva.com/25791/cl32b106kajnnne-25791845.pdf?src-supplier=Digi-Key; ComponentLink2URL: https://datasheet.ciiva.com/16437/cl32b106kajnnne-16437180.pdf?src-supplier=Future+Electronics; ComponentLink2Description: https://datasheet.ciiva.com/16437/cl32b106kajnnne-16437180.pdf?src-supplier=Future+Electronics; ComponentLink3URL: https://datasheet.ciiva.com/29202/450857-da-01-en-vs-kondensator-1210-29202679.pdf?src-supplier=Conrad; ComponentLink3Description: https://datasheet.ciiva.com/29202/450857-da-01-en-vs-kondensator-1210-29202679.pdf?src-supplier=Conrad
L1 = CMP-02424-000416-1: Fixed Inductors Commercial Low DCR Series 4.7uH 3.2A 81.3mΩ 20%; Manufacturer: Vishay Dale; Saturation Current: 3A; Shielding: Shielded; Core Material: Metal; Self Resonant Frequency: 27MHz; Test Frequency: 100kHz; DC Resistance (DCR): 81.3mR; Description: FIXED IND 4.7UH 3.2A 81.3 MOHM; Height - Seated (Max): 0.079inch; Mount: Surface Mount; Max Operating Temperature: 125°C; Termination: SMD/SMT; Depth: 5.43mm; Lead Free: Lead Free; Inductance Tolerance: 20%; Height: 2mm; Length: 5.49mm; Package Quantity: 2000; Tolerance: 20%; Min Operating Temperature: -55°C; Case/Package: 2020; Radiation Hardening: No; Number of Pins: 2020; Military Standard: Not; Inductance: 4.7uH; Packaging: Tape and Reel; Width: 0.204inch; Current Rating: 3.2A; RMS Current (Irms): 3.2A; Max DC Current: 3A; Supplier 1: Digi-Key; Manufacturer Part Number: IHLP2020BZER4R7M11; RoHS: Yes; Category: Fixed Inductors; Stock 1: 301; REACH SVHC: Unknown; ComponentLink1URL: https://datasheet.ciiva.com/11798/0900766b8102c92e-11798345.pdf?src-supplier=RSComponents; ComponentLink1Description: https://datasheet.ciiva.com/11798/0900766b8102c92e-11798345.pdf?src-supplier=RSComponents; ComponentLink2URL: https://datasheet.ciiva.com/16496/lp20bz11-16496630.pdf?src-supplier=Future+Electronics; ComponentLink2Description: https://datasheet.ciiva.com/16496/lp20bz11-16496630.pdf?src-supplier=Future+Electronics; ComponentLink3URL: https://datasheet.ciiva.com/1051/lp20bz11-1051771.pdf?src-supplier=Digi-Key; ComponentLink3Description: https://datasheet.ciiva.com/1051/lp20bz11-1051771.pdf?src-supplier=Digi-Key; ComponentLink4URL: https://datasheet.ciiva.com/1051/lp20bz11-1051772.pdf?src-supplier=Digi-Key; ComponentLink4Description: https://datasheet.ciiva.com/1051/lp20bz11-1051772.pdf?src-supplier=Digi-Key; ComponentLink5URL: https://datasheet.ciiva.com/1051/lp20bz11-1051773.pdf?src-supplier=Digi-Key; ComponentLink5Description: https://datasheet.ciiva.com/1051/lp20bz11-1051773.pdf?src-supplier=Digi-Key
LED1 = CMP-1426-00016-1: SMD mono-color Chip LED, WL-SMCW, Bright Green; Manufacturer: Wuerth Elektronik; Description: LED, Green, 570 nm, 2 V, 30 mA, 40 mcd; Luminous Intensity: 40mcd; Forward Current: 30mA; Forward Voltage: 2V; Viewing Angle: 140°; Lens Style: Clear,Rectangular; Wavelength: 570nm; Test Current: 20mA; ComponentLink2URL: http://katalog.we-online.com/led/datasheet/150120VS75000.pdf; PartNumber: 150120VS75000; Color: Bright Green; ComponentLink2Description: Datasheet; ComponentLink1URL: http://www.we-online.com; PackageReference: 1206_A; ComponentLink1Description: Manufacturer URL; Supplier 1: Digi-Key; Manufacturer Part Number: 150120VS75000; RoHS: Yes; Category: LEDs; Stock 1: 4286; Mount: Surface Mount; Case/Package: 1206; Case Code (Metric): 3216; Case Code (Imperial): 1206; Min Operating Temperature: -40°C; Max Operating Temperature: 85°C; Package Quantity: 1; Packaging: Tape and Reel; Dominant Wavelength: 570nm; Length: 3.2mm; Height: 0.68mm; Width: 1.6mm; REACH SVHC: Unknown; ComponentLink3URL: https://datasheet.ciiva.com/29561/150120vs75000-29561865.pdf?src-supplier=Digi-Key; ComponentLink3Description: https://datasheet.ciiva.com/29561/150120vs75000-29561865.pdf?src-supplier=Digi-Key; ComponentLink4URL: https://datasheet.ciiva.com/29279/759444-da-01-en-chipled-1206-w-kl-h-gruen-150120vs7500-29279050.pdf?src-supplier=Conrad; ComponentLink4Description: https://datasheet.ciiva.com/29279/759444-da-01-en-chipled-1206-w-kl-h-gruen-150120vs7500-29279050.pdf?src-supplier=Conrad; ComponentLink5URL: https://datasheet.ciiva.com/29561/150120vs75000-29561866.pdf?src-supplier=Digi-Key; ComponentLink5Description: https://datasheet.ciiva.com/29561/150120vs75000-29561866.pdf?src-supplier=Digi-Key; ComponentLink6URL: https://datasheet.ciiva.com/22656/1911467-22656987.pdf?src-supplier=Element14; ComponentLink6Description: https://datasheet.ciiva.com/22656/1911467-22656987.pdf?src-supplier=Element14; ComponentLink7URL: https://datasheet.ciiva.com/29561/150120vs75000-29561867.pdf?src-supplier=Digi-Key; ComponentLink7Description: https://datasheet.ciiva.com/29561/150120vs75000-29561867.pdf?src-supplier=Digi-Key
R1 = CMP-02407-003555-1: RES Thick Film, 220Ω, 1%, 0.1W, 100ppm/°C, 0603; Manufacturer: Vishay Dale; Voltage Rating: 75V; Power Rating: 100mW; Resistance: 220R; Description: RES SMD 220 OHM 1% 1/10W 0603; Length: 1.55mm; Weight: 7.1E-05oz; Package Quantity: 10000; Case/Package: 0603; Composition: Thick Film; Max Operating Temperature: 155°C; Military Standard: Not; Tolerance: 1%; Lead Free: Lead Free; Number of Terminations: 2; Min Operating Temperature: -55°C; Case Code (Imperial): 0603; Max Power Dissipation: 100mW; Features: Automotive AEC-Q200; Packaging: Tape and Reel; Temperature Coefficient: 100ppm/°C; Case Code (Metric): 1608; Termination: SMD/SMT; Depth: 0.85mm; Height: 0.02inch; Width: 0.85mm; Supplier 1: Digi-Key; Manufacturer Part Number: CRCW0603220RFKEB; RoHS: Yes; Category: Chip SMD Resistors; Stock 1: 12344; Resistor Type: Thick Film; ComponentLink1URL: https://datasheet.ciiva.com/16430/dcrcwe3-16430094.pdf?src-supplier=Future+Electronics; ComponentLink1Description: https://datasheet.ciiva.com/16430/dcrcwe3-16430094.pdf?src-supplier=Future+Electronics
U1 = 3.3V SW Reg (AP63203WU-7): AP63203 Series 3.3 V 2 A SMT Fixed Low IQ Synchronous Buck - TSOT-26; Manufacturer 1: Diodes; Supplier 1: Digi-Key; Supplier Part Number 1: AP63203WU-7DICT-ND; Stock 1: 9889; Pricing 1: 1=0.83000, 10=0.74500, 25=0.70720, 100=0.54290, 250=0.47976, 500=0.45450, 1000=0.35350 (USD); RoHS: No; ComponentLink1Description: https://datasheet.octopart.com/AP63203WU-7-Diodes-Inc.-datasheet-130008827.pdf; ComponentLink1URL: https://datasheet.octopart.com/AP63203WU-7-Diodes-Inc.-datasheet-130008827.pdf; ComponentLink2Description: https://sigma.octopart.com/138799930/technical_drawing/Diodes-Inc.-AP63203WU-7.pdf; ComponentLink2URL: https://sigma.octopart.com/138799930/technical_drawing/Diodes-Inc.-AP63203WU-7.pdf; Manufacturer: Diodes; Manufacturer Part Number: AP63203WU-7

## Sheet External_Housing.SchDoc
size A4
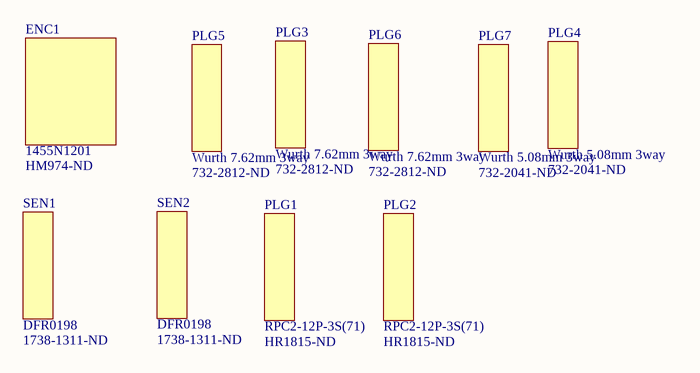
[diagram p4: External_Housing.SchDoc]

### Parts
ENC1  1455N1201  Supplier Part Number 1: HM974-ND
PLG1  RPC2-12P-3S(71)  Supplier Part Number 1: HR1815-ND
PLG2  RPC2-12P-3S(71)  Supplier Part Number 1: HR1815-ND
PLG3  Wurth 7.62mm 3way  Supplier Part Number 1: 732-2812-ND
PLG4  Wurth 5.08mm 3way  Supplier Part Number 1: 732-2041-ND
PLG5  Wurth 7.62mm 3way  Supplier Part Number 1: 732-2812-ND
PLG6  Wurth 7.62mm 3way  Supplier Part Number 1: 732-2812-ND
PLG7  Wurth 5.08mm 3way  Supplier Part Number 1: 732-2041-ND
SEN1  DFR0198  Supplier Part Number 1: 1738-1311-ND
SEN2  DFR0198  Supplier Part Number 1: 1738-1311-ND

### Library data of the parts
ENC1 = 1455N1201: HAMMOND         1455N1201            Enclosure, 1455 Series, Extruded With Metal End Panels, PCB Box, 53 mm, 103 mm, 120 mm, Aluminium; Manufacturer: Hammond Manufacturing; Ratings: IP40; Supplier 1: Digi-Key; Manufacturer Part Number: 1455N1201; RoHS: Yes; Category: Enclosures; Stock 1: 42; Case/Package: Metal; Weight: 0.66lb; Color: Clear,Black,Natural; Material: Aluminium,Metal; Housing Material: Aluminium; Body Material: Aluminium; Package Quantity: 1; Length: 4.724inch; Height: 2.087inch; Width: 4.06inch; Thickness: 0.06inch; REACH SVHC: No SVHC; ComponentLink1URL: https://datasheet.ciiva.com/4630/1455n1201-83616-4630121.pdf?src-supplier=Mouser; ComponentLink1Description: https://datasheet.ciiva.com/4630/1455n1201-83616-4630121.pdf?src-supplier=Mouser; ComponentLink2URL: https://datasheet.ciiva.com/20197/30-1572-20197097.pdf?src-supplier=Rapid+Electronics; ComponentLink2Description: https://datasheet.ciiva.com/20197/30-1572-20197097.pdf?src-supplier=Rapid+Electronics
PLG1 PLG2 = RPC2-12P-3S(71): CONN PLUG 3 POS W/SOCKETS; Manufacturer: Hirose; Number of Positions: 3; Current Rating: 5A; Voltage Rating: 250V; Supplier 1: Digi-Key; Manufacturer Part Number: RPC2-12P-3S(71); RoHS: Yes; Category: Circular Connectors; Stock 1: 1316; Mount: Free Hanging,Cable; Color: Blue; Contact Material: Bronze; Contact Plating: Silver; Insulation Material: Plastic; Shell Material: Plastic; Min Operating Temperature: -10°C; Max Operating Temperature: 60°C; Termination: Solder; Connector Type: Plug; Package Quantity: 50; Fastening Type: Push,Pull; Packaging: Tray; Number of Contacts: 3; Contact Gender: Female; Orientation: Straight; Radiation Hardening: No; Lead Free: Lead Free; ComponentLink1URL: https://datasheet.ciiva.com/549/e11300018-549107.pdf?src-supplier=Digi-Key; ComponentLink1Description: https://datasheet.ciiva.com/549/e11300018-549107.pdf?src-supplier=Digi-Key; ComponentLink2URL: https://datasheet.ciiva.com/3103/e11300018-3103307.pdf?src-supplier=Avnet; ComponentLink2Description: https://datasheet.ciiva.com/3103/e11300018-3103307.pdf?src-supplier=Avnet; ComponentLink3URL: https://datasheet.ciiva.com/16752/e11300018-16752447.pdf?src-supplier=Avnet+Europe; ComponentLink3Description: https://datasheet.ciiva.com/16752/e11300018-16752447.pdf?src-supplier=Avnet+Europe
PLG3 PLG5 PLG6 = Wurth 7.62mm 3way: Socket 3 Poles, 7.62 mm Pitch, 691351400003, Würth Elektronik; Manufacturer: Wurth Electronics; Number of Contacts: 3; Voltage Rating: 300V; Number of Levels: 1; Current: 20A; Wire/Cable Gauge: 24AWG; Pitch: 0.3inch; Wire Gauge (Min): 12AWG; Supplier 1: Digi-Key; Manufacturer Part Number: 691351400003; RoHS: Yes; Category: Terminal Blocks; Stock 1: 167; Mount: Free Hanging; Contact Material: Brass; Color: Green; Termination: Screw; Package Quantity: 130; Packaging: Bulk; Number of Positions Per Level: 3; Voltage: 300V; Current Rating: 20A; Length: 15.1mm; Width: 20.86mm; Wire Gauge (Max): 24AWG; REACH SVHC: Unknown; ComponentLink1URL: https://datasheet.ciiva.com/796/6913514000xx-796220.pdf?src-supplier=Digi-Key; ComponentLink1Description: https://datasheet.ciiva.com/796/6913514000xx-796220.pdf?src-supplier=Digi-Key
PLG4 PLG7 = Wurth 5.08mm 3way: TERM BLOCK PLUG 3POS STR 5.08MM; Manufacturer: Wurth Electronics; Manufacturer Part Number: 691351500003; Current Rating: 20A; Number of Positions Per Level: 3; Number of Levels: 1; Voltage: 300V; Pitch: 0.2inch; Wire/Cable Gauge: 24AWG; Wire Gauge (Min): 12AWG; Supplier 1: Digi-Key; RoHS: Yes; Category: Terminal Blocks; Stock 1: 1970; Mount: Free Hanging; Contact Material: Brass; Color: Green; Termination: Screw; Current: 20A; Number of Contacts: 3; Package Quantity: 250; Packaging: Bulk; Voltage Rating: 300V; Length: 18.2mm; Width: 15.24mm; Wire Gauge (Max): 24AWG; REACH SVHC: Unknown; ComponentLink1URL: https://datasheet.ciiva.com/796/6913515000xx-796335.pdf?src-supplier=Digi-Key; ComponentLink1Description: https://datasheet.ciiva.com/796/6913515000xx-796335.pdf?src-supplier=Digi-Key
SEN1 SEN2 = DFR0198: Waterproof DS18B20 Digital Temperature Sensor for Arduino; Manufacturer: DFRobot; Supplier 1: Digi-Key; Manufacturer Part Number: DFR0198; RoHS: No; Category: Temperature and Humidity Sensors; Stock 1: 602; Min Operating Temperature: -55°C; Max Operating Temperature: 125°C; ComponentLink1URL: https://media.digikey.com/pdf/Data%20Sheets/DFRobot%20PDFs/DFR0198_Web.pdf?src-supplier=Digi-Key; ComponentLink1Description: https://media.digikey.com/pdf/Data%20Sheets/DFRobot%20PDFs/DFR0198_Web.pdf?src-supplier=Digi-Key

## Nets that join several sheets
240V_L: TopLevel (F3.1), Relays (RLY1#1.3 RLY1#1.6 RLY2.3 RLY2.6)
+3V3: ESP32-WROOM-32D_Module (6 pins), Power (5 pins)
+5V: TopLevel (5 pins), Relays (6 pins), Power (C4.1 U1.2 U1.3)
GND: TopLevel (6 pins), Relays (Q1.2 Q2.2 R3.2 R5.2), ESP32-WROOM-32D_Module (36 pins), Power (5 pins)
NetCON1_2: TopLevel (CON1.2 R6.2), ESP32-WROOM-32D_Module (U2.11)
NetCON2_2: TopLevel (CON2.2 R7.2), ESP32-WROOM-32D_Module (U2.12)
NetCON4_1: TopLevel (CON4.1), Relays (RLY1#1.4 RLY1#1.5)
NetCON5_1: TopLevel (CON5.1), Relays (RLY2.4 RLY2.5)
NetQ1_1: Relays (Q1.1 R3.1), ESP32-WROOM-32D_Module (U2.8)
NetQ2_1: Relays (Q2.1 R5.1), ESP32-WROOM-32D_Module (U2.9)